# EAGLE schematic usb_device (EAGLE 5.09)
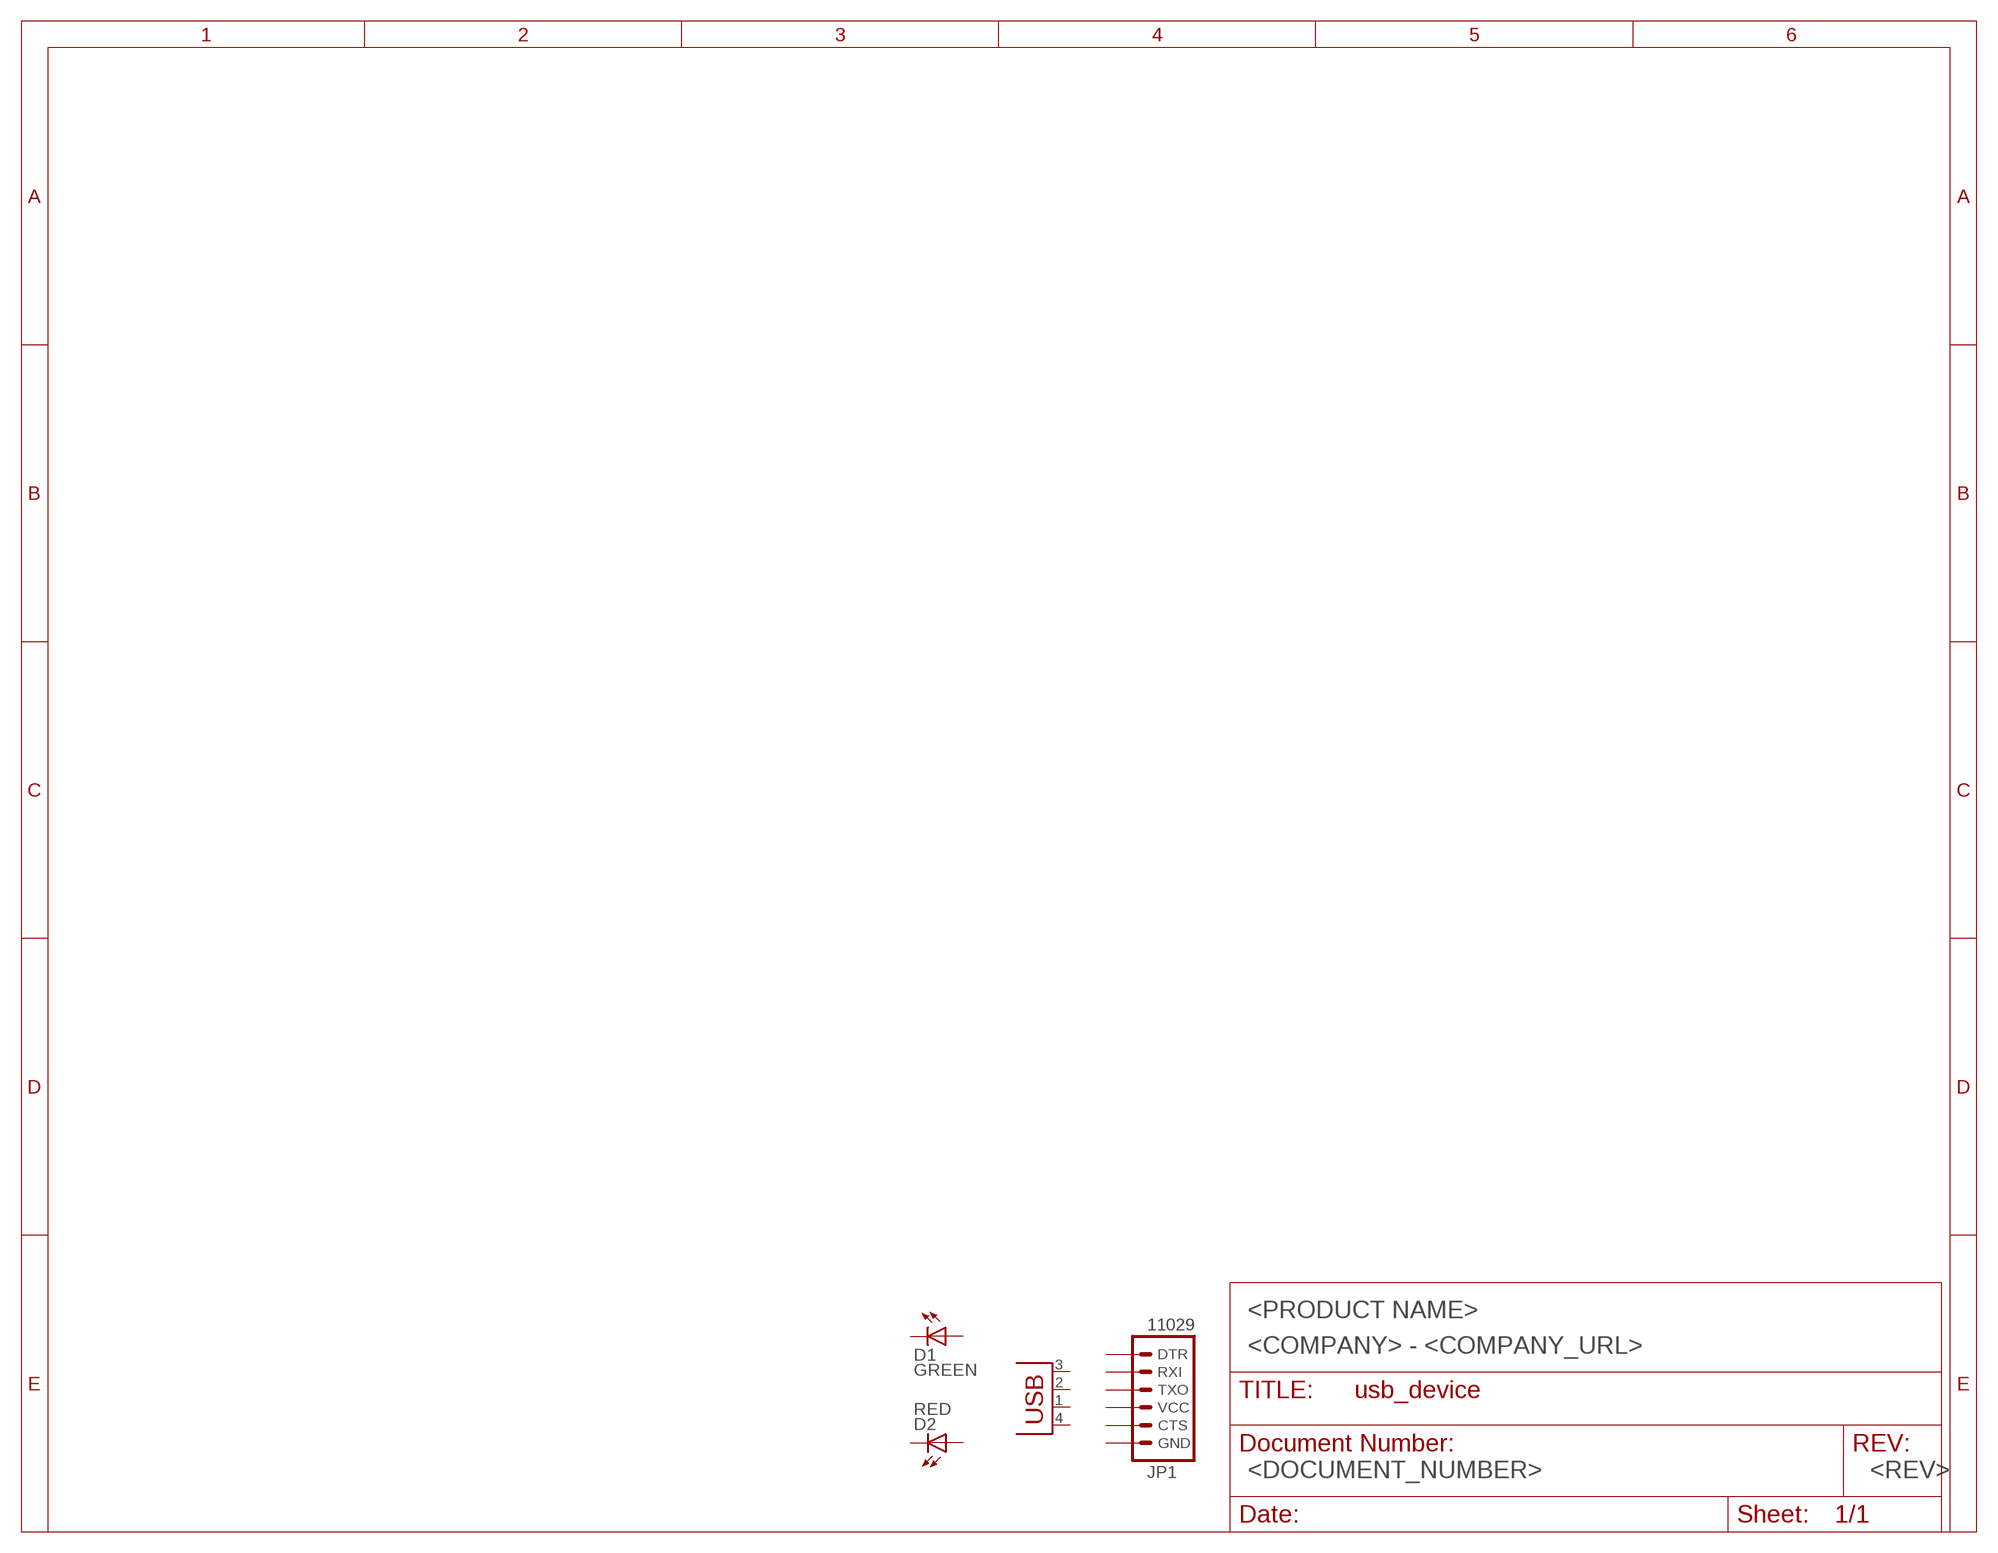
[diagram p0: schematic, sheet 1]

## Parts
D1  GREEN  LED1608  [LEDC1608]
D2  RED  LED1608  [LEDC1608]
JP1  11029  ARDUINO_SERIAL_PROGRAMSMD  [1X06-SMD]
P1  MOLEX_48037-1000  [MOLEX_48037-1000]
Unconnected: D1.A D1.C D2.A D2.C JP1.1(DTR) JP1.2(RXI) JP1.3(TXO) JP1.4(VCC) JP1.5(CTS) JP1.6(GND) P1.1(VBUS) P1.2(D-) P1.3(D+) P1.4(GND)

## Notes on the sheet
- <PRODUCT NAME>
- <COMPANY> - <COMPANY_URL>
- <DOCUMENT_NUMBER> | <REV>

## Library data of the parts
D1 D2 = cwilson:LED: LED
JP1 = SparkFun:ARDUINO_SERIAL_PROGRAM
P1 = cwilson-old:MOLEX_48037-1000

## Net classes
1 power: width 0.635 mm, clearance 0.406 mm